# Altium project CW308T_EFR32MG21.PrjPcb
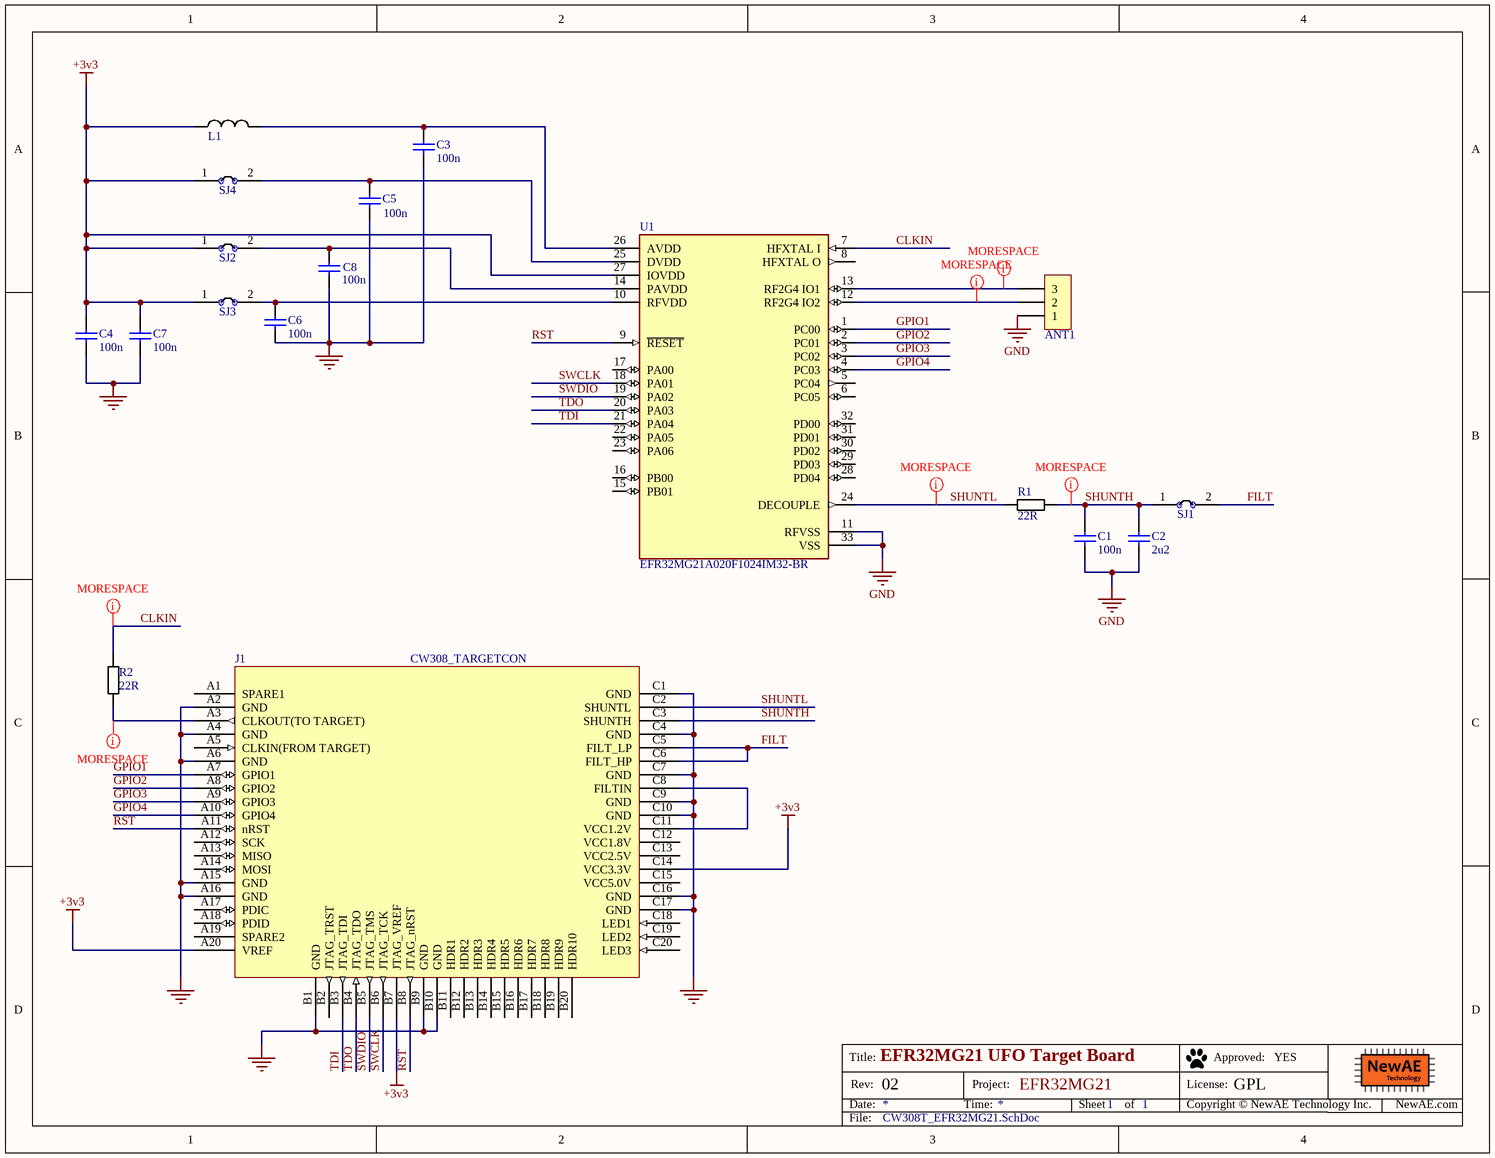
[diagram p0: CW308T_EFR32MG21.SchDoc]
PrjLicense: GPL; PrjName: EFR32MG21; PrjRev: 02
1 sheet, 18 parts. Net scope: global (net labels, ports and power ports of the same name join across sheets).
Board files: CW308T_EFR32MG21.PcbDoc, CW308T_EFR32MG21_PANEL.PcbDoc

## Sheet CW308T_EFR32MG21.SchDoc: EFR32MG21 UFO Target Board
size Letter; Organization: NewAE Technology Inc.; Address1: 1083 Queen St., Suite 196; Address2: Halifax; Address3: NS; Address4: Canada B3H 0B2; SheetNumber: 1; SheetTotal: 1; SheetApproved: YES

### Parts
ANT1  Straight Header Pins  [1x3_Straight_pins]  (value not drawn)
C1  100n  [CAPC0603_M]
C2  2u2  [CAPC0603_M]
C3  100n  [CAPC0603_M]
C4  100n  [CAPC0603_M]
C5  100n  [CAPC0603_M]
C6  100n  [CAPC0603_M]
C7  100n  [CAPC0603_M]
C8  100n  [CAPC0603_M]
J1  CW308_TARGETCON  [CW308_TBOARD_CONN]
L1  1k @ 1Mhz  [IND_0603]  (value not drawn)
R1  22R  [RESC1608X55N]
R2  22R  [RESC1608X55N]
SJ1  NC  [SJ_2S_NC]  (value not drawn)  (no BOM)
SJ2  NC  [SJ_2S_NC]  (value not drawn)  (no BOM)
SJ3  NC  [SJ_2S_NC]  (value not drawn)  (no BOM)
SJ4  NC  [SJ_2S_NC]  (value not drawn)  (no BOM)
U1  EFR32MG21A020F1024IM32-BR  [FP-EFR32MG21A020F1024IM32-MFG]

### Nets
+3v3: C4.1 C7.1 J1.A20(VREF) J1.B7(JTAG_VREF) J1.C14(VCC3.3V) L1.1 SJ2.1 SJ3.1 SJ4.1 U1.27(IOVDD)
GND: ANT1.1 C1.2 C2.2 C3.2 C4.2 C5.2 C6.2 C7.2 C8.2 J1.A2(GND) J1.A4(GND) J1.A6(GND) J1.A15(GND) J1.A16(GND) J1.B1(GND) J1.B9(GND) J1.B10(GND) J1.C1(GND) J1.C4(GND) J1.C7(GND) J1.C9(GND) J1.C10(GND) J1.C16(GND) J1.C17(GND) U1.11(RFVSS) U1.33(VSS)
CLKIN: R2.1 U1.7(HFXTAL_I)
FILT: J1.C5(FILT_LP) J1.C6(FILT_HP) SJ1.2
GPIO1: J1.A7(GPIO1) U1.1(PC00)
GPIO2: J1.A8(GPIO2) U1.2(PC01)
GPIO3: J1.A9(GPIO3) U1.3(PC02)
GPIO4: J1.A10(GPIO4) U1.4(PC03)
RST: J1.A11(nRST) J1.B8(JTAG_nRST) U1.9(~{RESET})
SHUNTH: C1.1 C2.1 J1.C3(SHUNTH) R1.2 SJ1.1
SHUNTL: J1.C2(SHUNTL) R1.1 U1.24(DECOUPLE)
SWCLK: J1.B6(JTAG_TCK) U1.18(PA01)
SWDIO: J1.B5(JTAG_TMS) U1.19(PA02)
TDI: J1.B3(JTAG_TDI) U1.21(PA04)
TDO: J1.B4(JTAG_TDO) U1.20(PA03)
NetANT1_2: ANT1.2 U1.12(RF2G4_IO2)
NetANT1_3: ANT1.3 U1.13(RF2G4_IO1)
NetC3_1: C3.1 L1.2 U1.26(AVDD)
NetC5_1: C5.1 SJ4.2 U1.25(DVDD)
NetC6_1: C6.1 SJ3.2 U1.10(RFVDD)
NetC8_1: C8.1 SJ2.2 U1.14(PAVDD)
NetJ1_A3: J1.A3(CLKOUT(TO_TARGET)) R2.2
NetJ1_C8: J1.C8(FILTIN) J1.C11(VCC1.2V)

Not connected (* = marked no-connect by the designer): J1 A1(SPARE1) A5(CLKIN(FROM_TARGET)) A12(SCK) A13(MISO) A14(MOSI) A17(PDIC) A18(PDID) A19(SPARE2) B2(JTAG_TRST) B11(HDR1) B12(HDR2) B13(HDR3) B14(HDR4) B15(HDR5) B16(HDR6) B17(HDR7) B18(HDR8) B19(HDR9) B20(HDR10) C12(VCC1.8V) C13(VCC2.5V) C15(VCC5.0V) C18(LED1) C19(LED2) C20(LED3); U1 5(PC04) 6(PC05) 8(HFXTAL_O) 15(PB01) 16(PB00) 17(PA00) 22(PA05) 23(PA06) 28(PD04) 29(PD03) 30(PD02) 31(PD01) 32(PD00)

### Layout directives
net class MORESPACE: CLKIN, NetANT1_2, NetANT1_3, NetJ1_A3, SHUNTH, SHUNTL

### Notes on the sheet
- Title:
- Date:
- Rev:
- Time:
- Project:
- Sheet
- of
- License:
- Copyright © NewAE Technology Inc.
- Approved:
- NewAE.com
- File:

### Library data of the parts
ANT1 = HDR_3PIN: 1x3 Straight pin header; Manufacture 1: Wurth Electronics Inc.; Manufacture Part Number 1: 61300311121; Component Group: Connector; PP Material Stack: 0; Part Number: HDR_3PIN; Pin Count: 3; Supplier 1: Digi-Key; Supplier Part Number 1: 732-5316-ND; Mounting Technology: Through-hole; RoHS: Yes; Component Kind: Standard; Component Type: Standard; PP Rotation: 0
C1 C3-C8 = CCHIP-100n-0603: 100n, 0603; Manufacture 1: Kemet; Manufacture Part Number 1: C0603C104K5RACTU; Component Group: Capacitor; Case-EIA: 0603; Case-Metric: 1608; Rated Voltage: 50VDC; Part Number: CCHIP-100n-0603; Footprint: 0603; Pin Count: 2; Supplier 1: Digi-Key; Supplier Part Number 1: 399-5089-2-ND; Value: 100n; Mounting Technology: SMT; Component Kind: Standard; Component Type: Standard
C2 = CCHIP-2u2-0603: 2u2, 0603; Manufacture 1: Samsung; Manufacture Part Number 1: CL10B225KP8NNNC; Component Group: Capacitor; Case-EIA: 0603; Case-Metric: 1608; Rated Voltage: 10VDC; Part Number: CCHIP-2u2-0603; Footprint: 0603; Pin Count: 2; Supplier 1: Digi-Key; Supplier Part Number 1: 1276-1134-2-ND; Value: 2u2; Mounting Technology: SMT; Component Kind: Standard; Component Type: Standard
J1 = CW308_TBOARD: CW308 "Standard" Target Board Connector; Component Group: Mechanical; Pitch: 2.54mm; Part Number: CW308_TBOARD; Pin Count: 60; Mounting Technology: Through-hole; Component Kind: Standard; Component Type: Standard
L1 = FBCHIP-1k-0603: Ferrite Beads HI CUR CHIP BD 0603 1000OHMS 25%; Manufacture 1: Taiyo Yuden; Manufacture Part Number 1: FBMH1608HM102-T / FBMH1608HM102-T / FBMH1608HM102-T / FBMH1608HM102-T; Component Group: Inductor; PP Material Stack: 0; Part Number: FBCHIP-1k-0603; Footprint: 0603; Pin Count: 2; Supplier 1: Mouser; Supplier Part Number 1: 963-FBMH1608HM102-T; Mounting Technology: SMT; RoHS: Yes; Component Kind: Standard; Component Type: Standard; PP Rotation: 0
R1 R2 = RCHIP-22R-0603: 22R res, 0603, 1%, 1/10W; Manufacture 1: Yageo; Manufacture Part Number 1: RC0603FR-0722RL; Component Group: Resistor; Case-EIA: 0603; Case-Metric: 1608; Rated Power: 0.1W; Rated Voltage: 75VDC; Part Number: RCHIP-22R-0603; Footprint: 0603; Pin Count: 2; Supplier 1: Digi-Key; Supplier Part Number 1: 311-22.0HRCT-ND; Value: 22R; Tolerance: 1%; Mounting Technology: SMT; Temperature Range: -55C to 155C; Component Kind: Standard; Component Type: Standard
SJ1-SJ4 = SJ_2S: Solder Jumper, NC; Component Group: PCB Feature; Part Number: SJ_2S; Pin Count: 2; Mounting Technology: COPPER; Component Type: Standard (No BOM)
U1 = CMP-08085-000003-1: IC MCU 2.4G 20DB MULTIPROTOCOL; Manufacturer: Silicon Labs; Frequency: 80MHz; Number Of I/Os: 20; Number Of Uart Channels: 3; Number Of Adc Channels: 1; Data Bus Width: 32bits; Memory Size: 1024KBytes; Max Junction Temp: +135°C; Standoff Height: 0mm; Ram Size: 96KBytes; Max Supply Voltage: 3.8V; Core Architecture: ARM Cortex-M33; Number Of Pwm Channels: 6; Number Of Timers/Counters: 5; Interface: I2C,SPI,UART,USART,IrDA,I2S,SMBus,RS-485,Other; Min Supply Voltage: 1.71V; Memory Type: FLASH; Number Of I2C Channels: 2; ComponentLink2URL: https://www.silabs.com/documents/public/data-sheets/efr32mg21-datasheet.pdf; Ambient Temperature Range Low: -40°C; Number Of Cores: 1; Device Class L2: Embedded Processors and Controllers; Ipc Land Pattern Name: QFN40P400X400X85-32; Package: 0; Automotive: No; Digikey Description: IC MCU 2.4G 20DB MULTIPROTOCOL; Lead Free: Yes; Number Of Spi Channels: 3; Manufacturer Part Number: EFR32MG21A020F1024IM32-BR; ComponentLink2Description: Datasheet; Height: 0.9mm; Ambient Temperature Range High: +125°C; RoHS: TRUE; Temperature Range High: +135°C; Category: IC; Octopart: https://octopart.com/efr32mg21a020f1024im32-br-silicon+labs-98975230; Device Class L3: Microcontrollers; Device Class L1: Integrated Circuits (ICs); Number Of A/D Converters: 1; Temperature: to +135°C